# EAGLE schematic Tx_328p (EAGLE 7.2.0)
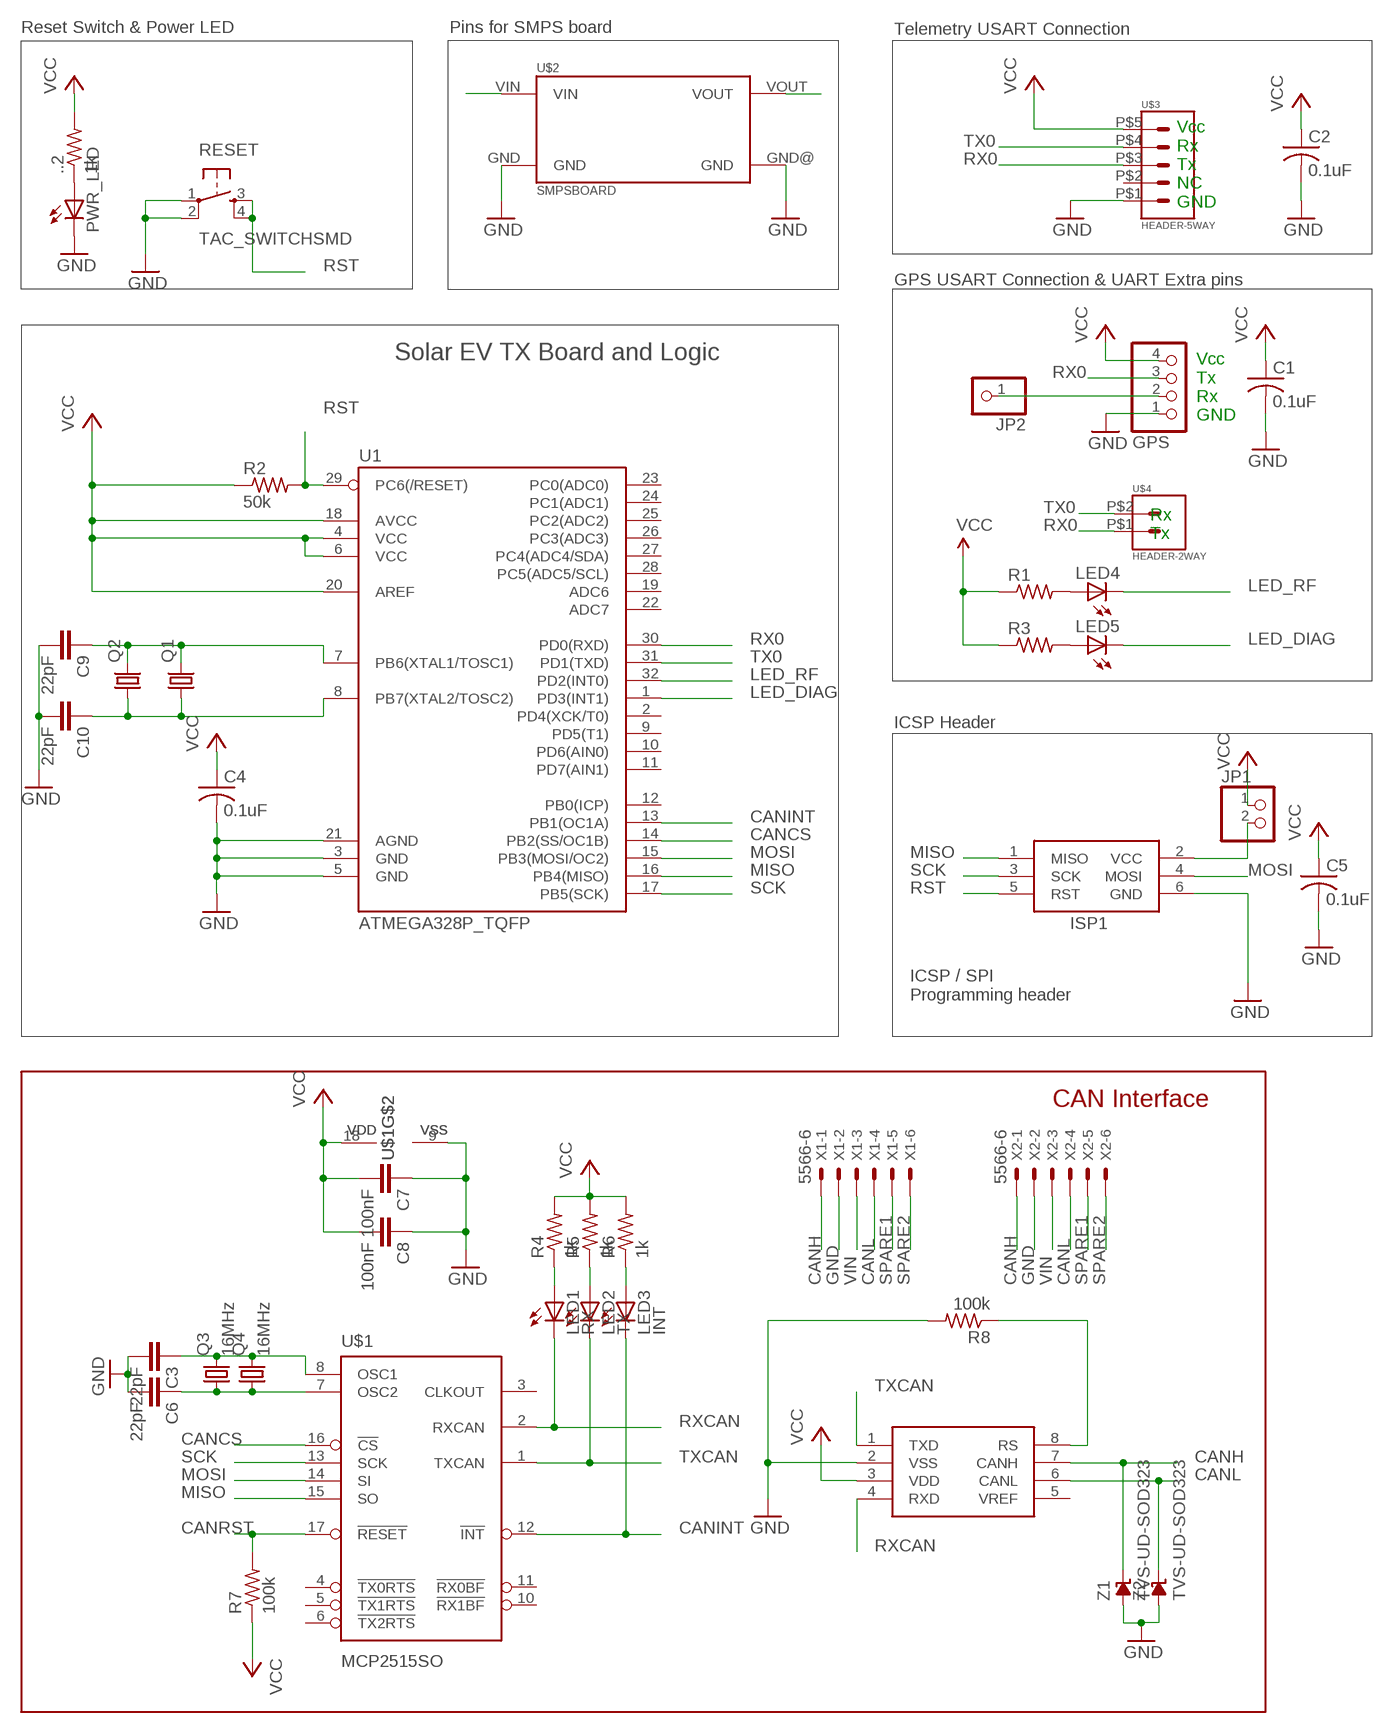
[diagram p0: schematic, sheet 1]

## Parts
..2  1k  R-US_M0805  [M0805]
C1  0.1uF  C-USC0805  [C0805]
C2  0.1uF  C-USC0805  [C0805]
C3  22pF  C-EUC0805K  [C0805K]
C4  0.1uF  C-USC0805  [C0805]
C5  0.1uF  C-USC0805  [C0805]
C6  22pF  C-EUC0805K  [C0805K]
C7  100nF  C-EUC0805K  [C0805K]
C8  100nF  C-EUC0805K  [C0805K]
C9  22pF  C-EUC0805K  [C0805K]
C10  22pF  C-EUC0805K  [C0805K]
GPS  PINHD-1X4  [1X04]
ISP1  AVRISP-BOX  [AVRISP-BOX]
JP1  PINHD-1X2  [1X02]
JP2  PINHD-1X1  [1X01]
LED1  RX  LEDCHIP-LED0805  [CHIP-LED0805]
LED2  TX  LEDCHIP-LED0805  [CHIP-LED0805]
LED3  INT  LEDCHIP-LED0805  [CHIP-LED0805]
LED4  LEDSML0805  [SML0805]
LED5  LEDSML0805  [SML0805]
PWR_LED  LEDCHIP-LED0805  [CHIP-LED0805]
Q1  CRYSTALHC49S  [HC49/S]
Q2  CRYSTALSM49  [SM49]
Q3  16MHz  CRYSTALHC49S  [HC49/S]
Q4  16MHz  CRYSTALHC49UP  [HC49UP]
R1  R-US_M0805  [M0805]
R2  50k  R-US_M0805  [M0805]
R3  R-US_M0805  [M0805]
R4  1k  R-US_R0805  [R0805]
R5  1k  R-US_R0805  [R0805]
R6  1k  R-US_R0805  [R0805]
R7  100k  R-US_R0805  [R0805]
R8  100k  R-US_R0805  [R0805]
RESET  TAC_SWITCHSMD  [TACTILE-SWITCH-SMD]
U1  ATMEGA328P_TQFP  [TQFP32-08]
U2  MCP2551  [SO08]
U$1  MCP2515SO  [SO-18W]
U$2  SMPSBOARD  [SMPSBOARD]
U$3  HEADER-5WAY  [1744426-5]
U$4  HEADER-2WAY  [1744426-2]
X1  5566-6  [5566-6]
X2  5566-6  [5566-6]
Z1  TVS-UD-SOD323  [SOD323]
Z2  TVS-UD-SOD323  [SOD323]

## Nets
CANCS: U1.14(PB2(SS/OC1B)) U$1.16(!CS)
CANH: U2.7(CANH) X1.1 X2.1 Z1.C
CANINT: LED3.C U1.13(PB1(OC1A)) U$1.12(!INT)
CANL: U2.6(CANL) X1.4 X2.4 Z2.C
CANRST: R7.2 U$1.17(!RESET)
CANSTBY: R8.1 U2.8(RS)
GND: C1.2 C2.2 C3.2 C4.2 C5.2 C6.2 C7.1 C8.1 C9.2 C10.2 GPS.1 ISP1.6(GND) PWR_LED.C R8.2 RESET.1 RESET.2 U1.3(GND) U1.5(GND) U1.21(AGND) U2.2(VSS) U$1.9(VSS) U$2.GND U$2.GND@(GND) U$3.P$1 X1.2 X2.2 Z1.A Z2.A
LED_DIAG: LED5.C U1.1(PD3(INT1))
LED_RF: LED4.C U1.32(PD2(INT0))
MISO: ISP1.1(MISO) U1.16(PB4(MISO)) U$1.15(SO)
MOSI: ISP1.4(MOSI) U1.15(PB3(MOSI/OC2)) U$1.14(SI)
N$1: C9.1 Q1.2 Q2.2 U1.7(PB6(XTAL1/TOSC1))
N$2: C10.1 Q1.1 Q2.1 U1.8(PB7(XTAL2/TOSC2))
N$3: GPS.2 JP2.1
N$4: LED4.A R1.2
N$5: LED5.A R3.2
N$7: ..2.1 PWR_LED.A
N$10: LED1.A R4.1
N$11: LED2.A R5.1
N$12: LED3.A R6.1
N$13: C3.1 Q3.2 Q4.2 U$1.8(OSC1)
N$14: C6.1 Q3.1 Q4.1 U$1.7(OSC2)
N$17: ISP1.2(VCC) JP1.2
RST: ISP1.5(RST) R2.2 RESET.3 RESET.4 U1.29(PC6(/RESET))
RX0: GPS.3 U1.30(PD0(RXD)) U$3.P$3 U$4.P$1
RXCAN: LED1.C U2.4(RXD) U$1.2(RXCAN)
SCK: ISP1.3(SCK) U1.17(PB5(SCK)) U$1.13(SCK)
SPARE1: X1.5 X2.5
SPARE2: X1.6 X2.6
TX0: U1.31(PD1(TXD)) U$3.P$4 U$4.P$2
TXCAN: LED2.C U2.1(TXD) U$1.1(TXCAN)
VCC: ..2.2 C1.1 C2.1 C4.1 C5.1 C7.2 C8.2 GPS.4 JP1.1 R1.1 R2.1 R3.1 R4.2 R5.2 R6.2 R7.1 U1.4(VCC) U1.6(VCC) U1.18(AVCC) U1.20(AREF) U2.3(VDD) U$1.18(VDD) U$2.VOUT U$3.P$5
VIN: U$2.VIN X1.3 X2.3
Unconnected: U1.2(PD4(XCK/T0)) U1.9(PD5(T1)) U1.10(PD6(AIN0)) U1.11(PD7(AIN1)) U1.12(PB0(ICP)) U1.19(ADC6) U1.22(ADC7) U1.23(PC0(ADC0)) U1.24(PC1(ADC1)) U1.25(PC2(ADC2)) U1.26(PC3(ADC3)) U1.27(PC4(ADC4/SDA)) U1.28(PC5(ADC5/SCL)) U2.5(VREF) U$1.3(CLKOUT) U$1.4(!TX0RTS) U$1.5(!TX1RTS) U$1.6(!TX2RTS) U$1.10(!RX1BF) U$1.11(!RX0BF) U$3.P$2

## Notes on the sheet
- Reset Switch & Power LED | Pins for SMPS board | Telemetry USART Connection
- Vcc
  Rx
  Tx
  NC
  GND
- GPS USART Connection & UART Extra pins
- Solar EV TX Board and Logic
- Vcc
  Tx
  Rx
  GND
- Rx
  Tx
- ICSP Header
- ICSP / SPI
  Programming header
- CAN Interface

## Library data of the parts
..2 = rcl:R-US_: RESISTOR, American symbol
C1 C2 C4 C5 = resistor:C-US: CAPACITOR, American symbol
C3 C6-C10 = resistor:C-EU: CAPACITOR, European symbol
GPS = pinhead:PINHD-1X4: PIN HEADER
ISP1 = adafruit:AVRISP: AVR ISP HEADER Standard 6 pin header for AVR programming
JP1 = pinhead:PINHD-1X2: PIN HEADER
JP2 = pinhead:PINHD-1X1: PIN HEADER
LED1-LED5 PWR_LED = led:LED: LED OSRAM: - CHIPLED LG R971, LG N971, LY N971, LG Q971, LY Q971, LO R971, LY R971 LH N974, LH R974 LS Q976, LO Q976, LY Q976 LO Q996 - Hyper CHIPLED LW Q18S LB Q993, LB Q99A, LB R99A - SideLED LS A670, LO A670, LY A670, LG A670, LP A670 LB A673, LV A673, LT A673, LW A673 LH A674 LY A675 LS A676, LA A676, LO A676, LY A676, LW A676 LS A679, LY A679, LG A679 - Hyper Micro SIDELED® LS Y876, LA Y876, LO Y876, LY Y876 LT Y87S - SmartLED LW L88C, LW L88S LB L89C, LB L89S, LG L890 LS L89K, LO L89K, LY L89K LS L896, LA L896, LO L896, LY L896 - TOPLED LS T670, LO T670, LY T670, LG T670, LP T670 LSG T670, LSP T670, LSY T670, LOP T670, LYG T670 LG T671, LOG T671, LSG T671 LB T673, LV T673, LT T673, LW T673 LH T674 LS T676, LA T676, LO T676, LY T676, LB T676, LH T676, LSB T676, LW T676 LB T67C, LV T67C, LT T67C, LS T67K, LO T67K, LY T67K, LW E67C LS E67B, LA E67B, LO E67B, LY E67B, LB E67C, LV E67C, LT E67C LW T67C LS T679, LY T679, LG T679 LS T770, LO T770, LY T770, LG T770, LP T770 LB T773, LV T773, LT T773, LW T773 LH T774 LS E675, LA E675, LY E675, LS T675 LS T776, LA T776, LO T776, LY T776, LB T776 LHGB T686 LT T68C, LB T68C - Hyper Mini TOPLED® LB M676 - Mini TOPLED Santana® LG M470 LS M47K, LO M47K, LY M47K Source: http://www.osram.convergy.de LUXEON: - LUMILED® LXK2-PW12-R00, LXK2-PW12-S00, LXK2-PW14-U00, LXK2-PW14-V00 LXK2-PM12-R00, LXK2-PM12-S00, LXK2-PM14-U00 LXK2-PE12-Q00, LXK2-PE12-R00, LXK2-PE12-S00, LXK2-PE14-T00, LXK2-PE14-U00 LXK2-PB12-K00, LXK2-PB12-L00, LXK2-PB12-M00, LXK2-PB14-N00, LXK2-PB14-P00, LXK2-PB14-Q00 LXK2-PR12-L00, LXK2-PR12-M00, LXK2-PR14-Q00, LXK2-PR14-R00 LXK2-PD12-Q00, LXK2-PD12-R00, LXK2-PD12-S00 LXK2-PH12-R00, LXK2-PH12-S00 LXK2-PL12-P00, LXK2-PL12-Q00, LXK2-PL12-R00 Source: www.luxeon.com KINGBRIGHT: KA-3528ASYC Source: www.kingbright.com
Q1 Q3 = crystal:CRYSTAL: CRYSTAL; OC_FARNELL: 1667008; OC_NEWARK: unknown
Q2 Q4 = crystal:CRYSTAL: CRYSTAL; OC_FARNELL: unknown; OC_NEWARK: unknown
R1-R8 = resistor:R-US_: RESISTOR, American symbol
RESET = SparkFun-Retired:TAC_SWITCH: Momentary Switch Button commonly used for reset or general input. Spark Fun Electronics SKU : COM-00097 SMT- SWCH-08247; PROD_ID: SWCH-08247
U1 = SparkFun-DigitalIC:ATMEGA328P_TQFP; PROD_ID: IC-09069
U2 = SparkFun:MCP2551
U$1 = RobThePyro:MCP2515: MCP2515 CAN Controller by Microchip
U$2 = RobThePyro:SMPSBOARD
U$3 = con-TE-EP:HEADER-5WAY
U$4 = con-TE-EP:HEADER-2WAY
X1 X2 = con-molex:5566-6: Mini FIT connector 6 pol Source: http://www.molex.com; MPN: 95566-61002; OC_FARNELL: unknown; OC_NEWARK: 22K8620
Z1 Z2 = supressor:TVS-UD-: TVS UNI-DIRECTIONAL